# EAGLE design SIMM Board (EAGLE 6.4)
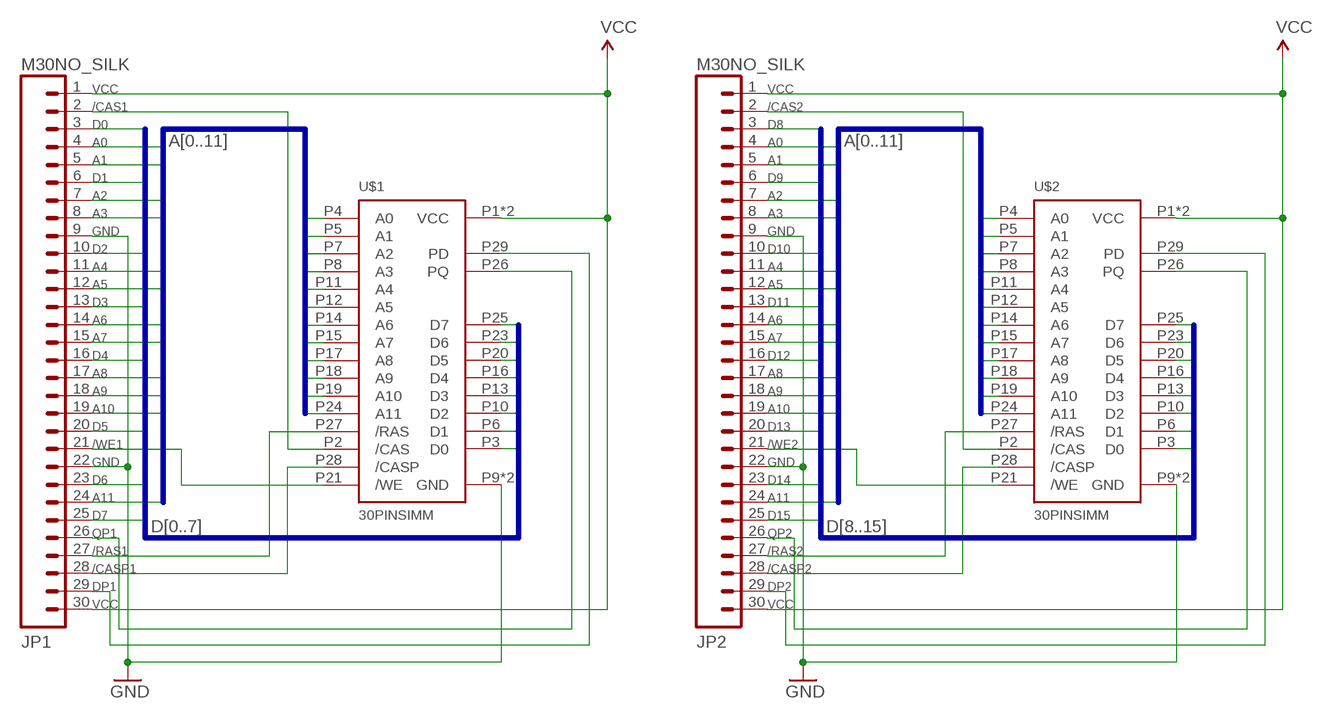
[diagram p0: schematic, sheet 1]

## Parts
JP1  M30NO_SILK  [1X30_NO_SILK]
JP2  M30NO_SILK  [1X30_NO_SILK]
U$1  30PINSIMM  [30PINSIMM]
U$2  30PINSIMM  [30PINSIMM]

## Nets
/CAS1: JP1.2 U$1.P2(/CAS)
/CAS2: JP2.2 U$2.P2(/CAS)
/CASP1: JP1.28 U$1.P28(/CASP)
/CASP2: JP2.28 U$2.P28(/CASP)
/RAS1: JP1.27 U$1.P27(/RAS)
/RAS2: JP2.27 U$2.P27(/RAS)
/WE1: JP1.21 U$1.P21(/WE)
/WE2: JP2.21 U$2.P21(/WE)
A0: JP1.4 JP2.4 U$1.P4(A0) U$2.P4(A0)
A1: JP1.5 JP2.5 U$1.P5(A1) U$2.P5(A1)
A2: JP1.7 JP2.7 U$1.P7(A2) U$2.P7(A2)
A3: JP1.8 JP2.8 U$1.P8(A3) U$2.P8(A3)
A4: JP1.11 JP2.11 U$1.P11(A4) U$2.P11(A4)
A5: JP1.12 JP2.12 U$1.P12(A5) U$2.P12(A5)
A6: JP1.14 JP2.14 U$1.P14(A6) U$2.P14(A6)
A7: JP1.15 JP2.15 U$1.P15(A7) U$2.P15(A7)
A8: JP1.17 JP2.17 U$1.P17(A8) U$2.P17(A8)
A9: JP1.18 JP2.18 U$1.P18(A9) U$2.P18(A9)
A10: JP1.19 JP2.19 U$1.P19(A10) U$2.P19(A10)
A11: JP1.24 JP2.24 U$1.P24(A11) U$2.P24(A11)
D0: JP1.3 U$1.P3(D0)
D1: JP1.6 U$1.P6(D1)
D2: JP1.10 U$1.P10(D2)
D3: JP1.13 U$1.P13(D3)
D4: JP1.16 U$1.P16(D4)
D5: JP1.20 U$1.P20(D5)
D6: JP1.23 U$1.P23(D6)
D7: JP1.25 U$1.P25(D7)
D8: JP2.3 U$2.P3(D0)
D9: JP2.6 U$2.P6(D1)
D10: JP2.10 U$2.P10(D2)
D11: JP2.13 U$2.P13(D3)
D12: JP2.16 U$2.P16(D4)
D13: JP2.20 U$2.P20(D5)
D14: JP2.23 U$2.P23(D6)
D15: JP2.25 U$2.P25(D7)
DP1: JP1.29 U$1.P29(PD)
DP2: JP2.29 U$2.P29(PD)
GND: JP1.9 JP1.22 JP2.9 JP2.22 U$1.P9(GND) U$1.P22(GND) U$2.P9(GND) U$2.P22(GND)
QP1: JP1.26 U$1.P26(PQ)
QP2: JP2.26 U$2.P26(PQ)
VCC: JP1.1 JP1.30 JP2.1 JP2.30 U$1.P1(VCC) U$1.P30(VCC) U$2.P1(VCC) U$2.P30(VCC)

## Buses
A[0..11]
D[0..7]
D[8..15]

## Library data of the parts
JP1 JP2 = SparkFun-Connectors:M30: 1x30 .1" header
U$1 U$2 = Benchoff:30PINSIMM

## Board
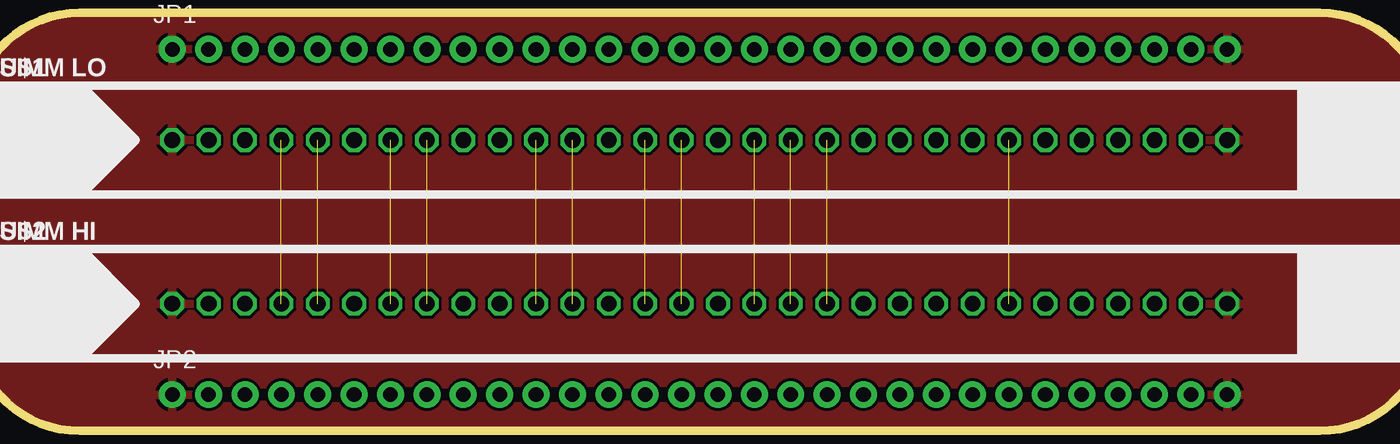
[diagram p1: board, top side]
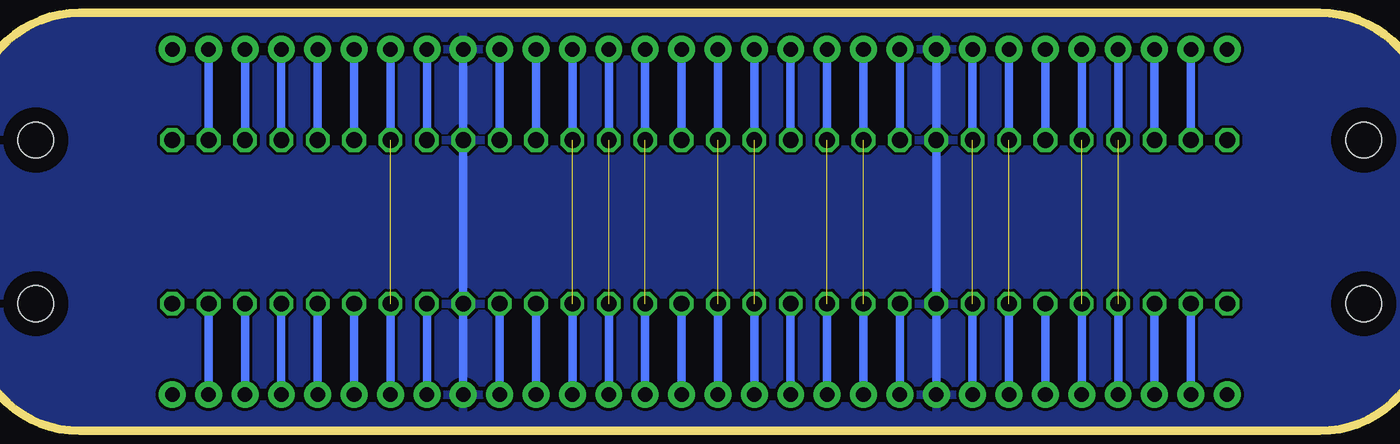
[diagram p2: board, bottom side, seen from below]

No outline drawn. Coordinates in mm, seen from the top.
Copper layers (1*16): Top 0.035mm / dielectric 1.5mm / Bottom 0.035mm
Design rules "default": minimum track width 10mil, minimum drill 24mil, track to track 8mil, track to pad 8mil, pad to pad 8mil, via to via 8mil, smd to smd 8mil, copper to edge 40mil, drill to drill 8mil, minimum pad ring 10mil, minimum via ring 8mil, stop-mask expansion 4mil, vias tented up to drill 0mil, thermal gap 10mil
Milling: 8 lines

### Footprints (pad centres in the part's own frame; a part is rotated, then mirrored left to right if it is on the bottom)
1X30_NO_SILK = drill 1.016 pad 1.88: 1 0,0; 2 2.54,0; 3 5.08,0; 4 7.62,0; 5 10.16,0; 6 12.7,0; 7 15.24,0; 8 17.78,0; 9 20.32,0; 10 22.86,0; 11 25.4,0; 12 27.94,0; 13 30.48,0; 14 33.02,0; 15 35.56,0; 16 38.1,0; 17 40.64,0; 18 43.18,0; 19 45.72,0; 20 48.26,0; 21 50.8,0; 22 53.34,0; 23 55.88,0; 24 58.42,0; 25 60.96,0; 26 63.5,0; 27 66.04,0; 28 68.58,0; 29 71.12,0; 30 73.66,0
30PINSIMM = drill 1.1 octagon: P1 -36.83,0; P2 -34.29,0; P3 -31.75,0; P4 -29.21,0; P5 -26.67,0; P6 -24.13,0; P7 -21.59,0; P8 -19.05,0; P9 -16.51,0; P10 -13.97,0; P11 -11.43,0; P12 -8.89,0; P13 -6.35,0; P14 -3.81,0; P15 -1.27,0; P16 1.27,0; P17 3.81,0; P18 6.35,0; P19 8.89,0; P20 11.43,0; P21 13.97,0; P22 16.51,0; P23 19.05,0; P24 21.59,0; P25 24.13,0; P26 26.67,0; P27 29.21,0; P28 31.75,0; P29 34.29,0; P30 36.83,0 | hole 2.489: -46.355,0; 46.355,0

### Placement (x,y rotation side)
JP1  13.97,27.94 0 top
JP2  13.97,3.81 0 top
U$1  50.8,21.59 0 top
U$2  50.8,10.16 0 top

### Tracks (layer width: path | path; a pad name or v marks a point on that pad's centre or on a via)
/CAS1
  Bottom 0.61: JP1.2 U$1.P2
/CAS2
  Bottom 0.61: JP2.2 U$2.P2
/CASP1
  Bottom 0.61: U$1.P28 JP1.28
/CASP2
  Bottom 0.61: JP2.28 U$2.P28
/RAS1
  Bottom 0.61: U$1.P27 JP1.27
/RAS2
  Bottom 0.61: JP2.27 U$2.P27
/WE1
  Bottom 0.61: U$1.P21 JP1.21
/WE2
  Bottom 0.61: JP2.21 U$2.P21
A0  (1 unrouted)
  Bottom 0.61: U$1.P4 JP1.4 | JP2.4 U$2.P4
A1  (1 unrouted)
  Bottom 0.61: U$1.P5 JP1.5 | JP2.5 U$2.P5
A2  (1 unrouted)
  Bottom 0.61: U$1.P7 JP1.7 | JP2.7 U$2.P7
A3  (1 unrouted)
  Bottom 0.61: U$1.P8 JP1.8 | JP2.8 U$2.P8
A4  (1 unrouted)
  Bottom 0.61: U$1.P11 JP1.11 | JP2.11 U$2.P11
A5  (1 unrouted)
  Bottom 0.61: U$1.P12 JP1.12 | JP2.12 U$2.P12
A6  (1 unrouted)
  Bottom 0.61: U$1.P14 JP1.14 | JP2.14 U$2.P14
A7  (1 unrouted)
  Bottom 0.61: U$1.P15 JP1.15 | JP2.15 U$2.P15
A8  (1 unrouted)
  Bottom 0.61: U$1.P17 JP1.17 | JP2.17 U$2.P17
A9  (1 unrouted)
  Bottom 0.61: U$1.P18 JP1.18 | JP2.18 U$2.P18
A10  (1 unrouted)
  Bottom 0.61: U$1.P19 JP1.19 | JP2.19 U$2.P19
A11  (1 unrouted)
  Bottom 0.61: U$1.P24 JP1.24 | JP2.24 U$2.P24
D0
  Bottom 0.61: U$1.P3 JP1.3
D1
  Bottom 0.61: U$1.P6 JP1.6
D2
  Bottom 0.61: U$1.P10 JP1.10
D3
  Bottom 0.61: U$1.P13 JP1.13
D4
  Bottom 0.61: U$1.P16 JP1.16
D5
  Bottom 0.61: U$1.P20 JP1.20
D6
  Bottom 0.61: U$1.P23 JP1.23
D7
  Bottom 0.61: U$1.P25 JP1.25
D8
  Bottom 0.61: JP2.3 U$2.P3
D9
  Bottom 0.61: JP2.6 U$2.P6
D10
  Bottom 0.61: JP2.10 U$2.P10
D11
  Bottom 0.61: JP2.13 U$2.P13
D12
  Bottom 0.61: JP2.16 U$2.P16
D13
  Bottom 0.61: JP2.20 U$2.P20
D14
  Bottom 0.61: JP2.23 U$2.P23
D15
  Bottom 0.61: JP2.25 U$2.P25
DP1
  Bottom 0.61: U$1.P29 JP1.29
DP2
  Bottom 0.61: JP2.29 U$2.P29
GND
  Bottom 0.61: JP1.9 U$1.P9 JP2.9 | JP1.22 U$1.P22 JP2.22
  pour Bottom: 93.98,30.48 7.62,30.48 arc90 0,22.86 0,8.89 arc90 7.62,1.27 93.98,1.27 arc90 101.6,8.89 101.6,22.86 arc90
QP1
  Bottom 0.61: U$1.P26 JP1.26
QP2
  Bottom 0.61: JP2.26 U$2.P26
VCC
  pour Top: 7.62,1.27 93.98,1.27 arc90 101.6,8.89 101.6,22.86 arc90 93.98,30.48 7.62,30.48 arc90 0,22.86 0,8.89 arc90

### Text on the board
tPlace: SIMM LO | SIMM HI